# Altium project Screen.PrjPcb
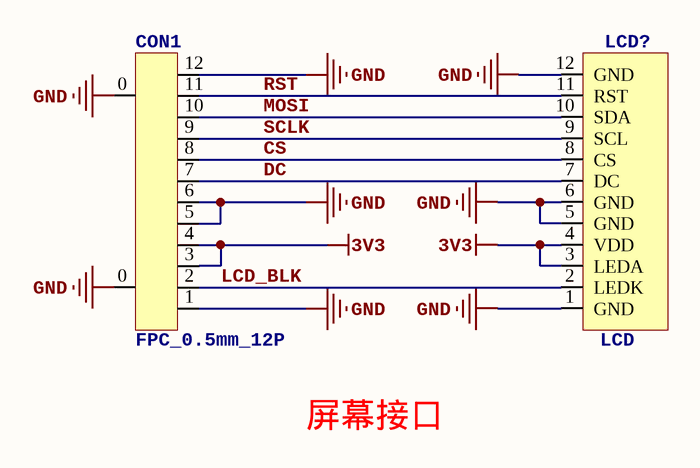
[diagram p0: Screen.SchDoc]
1 sheet, 2 parts. Net scope: global (net labels, ports and power ports of the same name join across sheets).
Board file: Screen.PcbDoc

## Sheet Screen.SchDoc
size A4

### Parts
CON1  FPC_0.5mm_12P
LCD  LCD?

### Nets
3V3: CON1.3 CON1.4 LCD.3(LEDA) LCD.4(VDD)
GND: CON1.0 CON1.1 CON1.5 CON1.6 CON1.12 LCD.1(GND) LCD.5(GND) LCD.6(GND) LCD.12(GND)
CS: CON1.8 LCD.8(CS)
DC: CON1.7 LCD.7(DC)
LCD_BLK: CON1.2 LCD.2(LEDK)
MOSI: CON1.10 LCD.10(SDA)
RST: CON1.11 LCD.11(RST)
SCLK: CON1.9 LCD.9(SCL)

### Notes on the sheet
- 屏幕接口

### Library data of the parts
CON1 = FPC_0.5mm_12P: FPC连接器
LCD = LCD: 屏幕排线接口